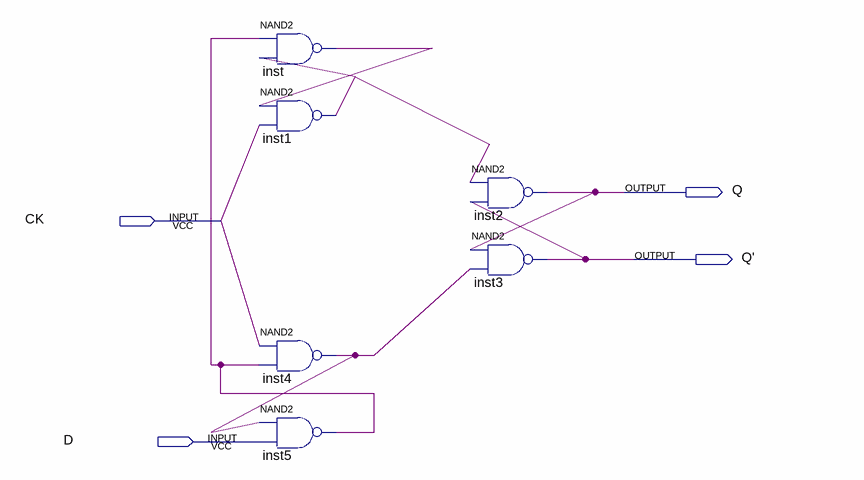
[diagram p0: schematic sheet]
// Quartus schematic 5.bdf as structural Verilog: 6 symbols, 4 pins
module \5  (
  input  CK,
  input  D,
  output Q,
  output \Q' 
);

  wire inst1_out, inst4_out, inst5_out, inst_out;

  nand inst (inst_out, inst5_out, inst1_out);
  nand inst1 (inst1_out, inst_out, CK);
  nand inst4 (inst4_out, CK, inst5_out);
  nand inst5 (inst5_out, inst4_out, D);
  nand inst2 (Q, inst1_out, \Q' );
  nand inst3 (\Q' , Q, inst4_out);
endmodule
